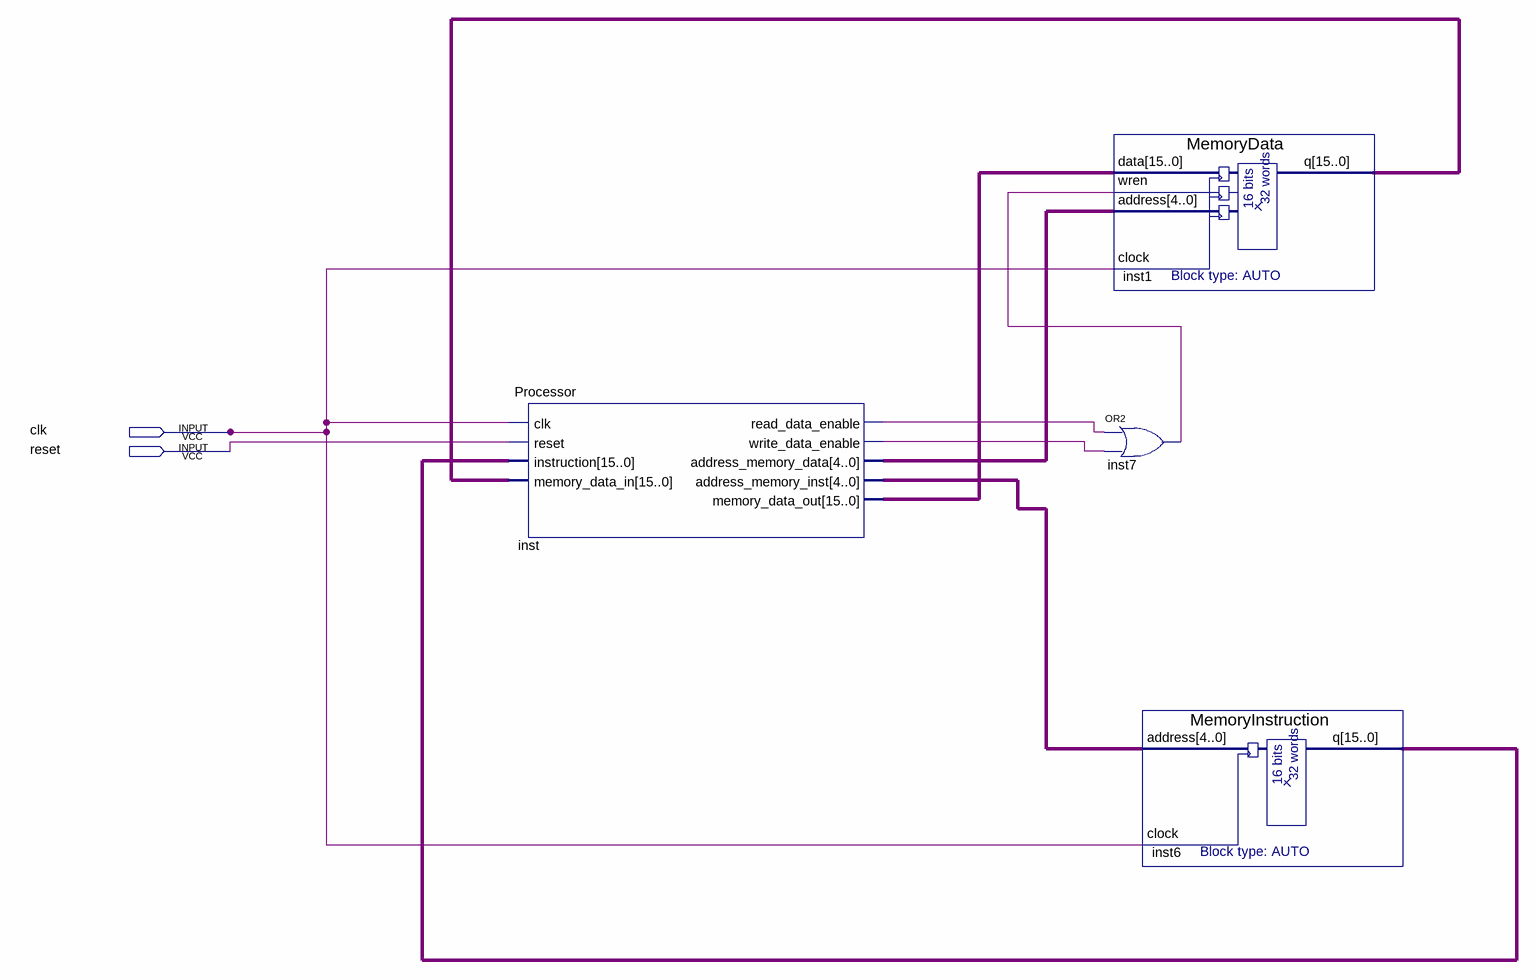
[diagram p0: schematic sheet]
// Quartus schematic Processor0Address.bdf as structural Verilog: 4 symbols, 2 pins
module Processor0Address (
  input  clk,
  input  reset
);

  wire inst7_out, inst_read_data_enable, inst_write_data_enable;
  wire [4:0] inst_address_memory_data, inst_address_memory_inst;
  wire [15:0] inst1_q, inst6_q, inst_memory_data_out;

  Processor inst (
    .clk(clk), .reset(reset), .instruction(inst6_q), .memory_data_in(inst1_q),
    .read_data_enable(inst_read_data_enable), .write_data_enable(inst_write_data_enable),
    .address_memory_data(inst_address_memory_data), .address_memory_inst(inst_address_memory_inst),
    .memory_data_out(inst_memory_data_out));
  or inst7 (inst7_out, inst_read_data_enable, inst_write_data_enable);
  MemoryData inst1 (
    .data(inst_memory_data_out), .wren(inst7_out), .address(inst_address_memory_data), .clock(clk),
    .q(inst1_q));
  MemoryInstruction inst6 (.address(inst_address_memory_inst), .clock(clk), .q(inst6_q));
endmodule
